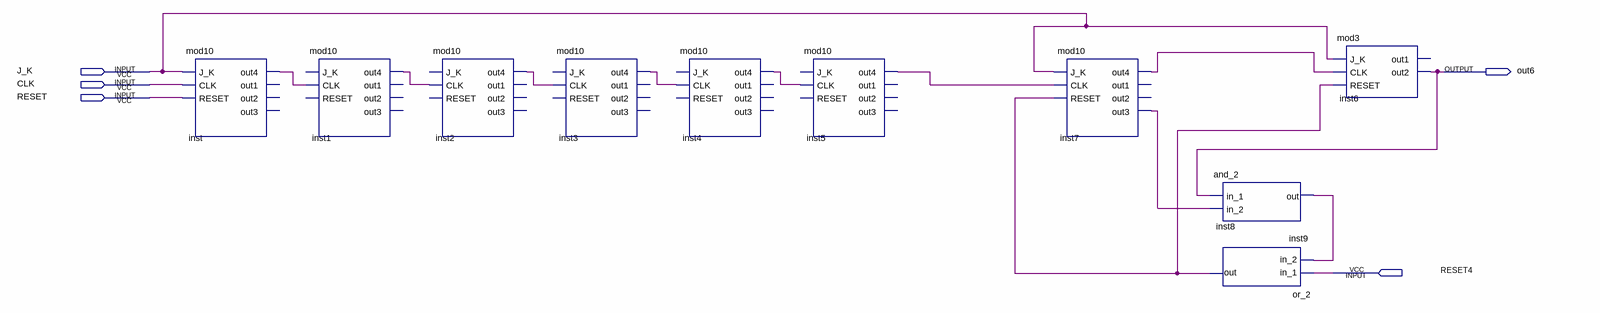
[diagram p0: schematic sheet]
// Quartus schematic conut.bdf as structural Verilog: 10 symbols, 5 pins
module conut (
  input  J_K,
  input  CLK,
  input  RESET,
  input  RESET4,
  output out6
);

  wire inst1_out4, inst2_out4, inst3_out4, inst4_out4, inst5_out4, inst7_out3, inst7_out4, inst8_out,
       inst9_out, inst_out4;

  mod10 inst (.J_K(J_K), .CLK(CLK), .RESET(RESET), .out4(inst_out4));  // open: out1, out2, out3
  mod10 inst1 (.CLK(inst_out4), .out4(inst1_out4));  // open: J_K, RESET, out1, out2, out3
  mod10 inst2 (.CLK(inst1_out4), .out4(inst2_out4));  // open: J_K, RESET, out1, out2, out3
  mod10 inst3 (.CLK(inst2_out4), .out4(inst3_out4));  // open: J_K, RESET, out1, out2, out3
  mod10 inst4 (.CLK(inst3_out4), .out4(inst4_out4));  // open: J_K, RESET, out1, out2, out3
  mod10 inst5 (.CLK(inst4_out4), .out4(inst5_out4));  // open: J_K, RESET, out1, out2, out3
  mod10 inst7 (
    .J_K(J_K), .CLK(inst5_out4), .RESET(inst9_out), .out4(inst7_out4), .out3(inst7_out3));  // open: out1, out2
  and_2 inst8 (.in_1(out6), .in_2(inst7_out3), .out(inst8_out));
  or_2 inst9 (.in_1(RESET4), .in_2(inst8_out), .out(inst9_out));
  mod3 inst6 (.J_K(J_K), .CLK(inst7_out4), .RESET(inst9_out), .out2(out6));  // open: out1
endmodule
